# EAGLE schematic e1-tracer (EAGLE 7.7.0)
REVISION: v1

## Sheet 1 of 2
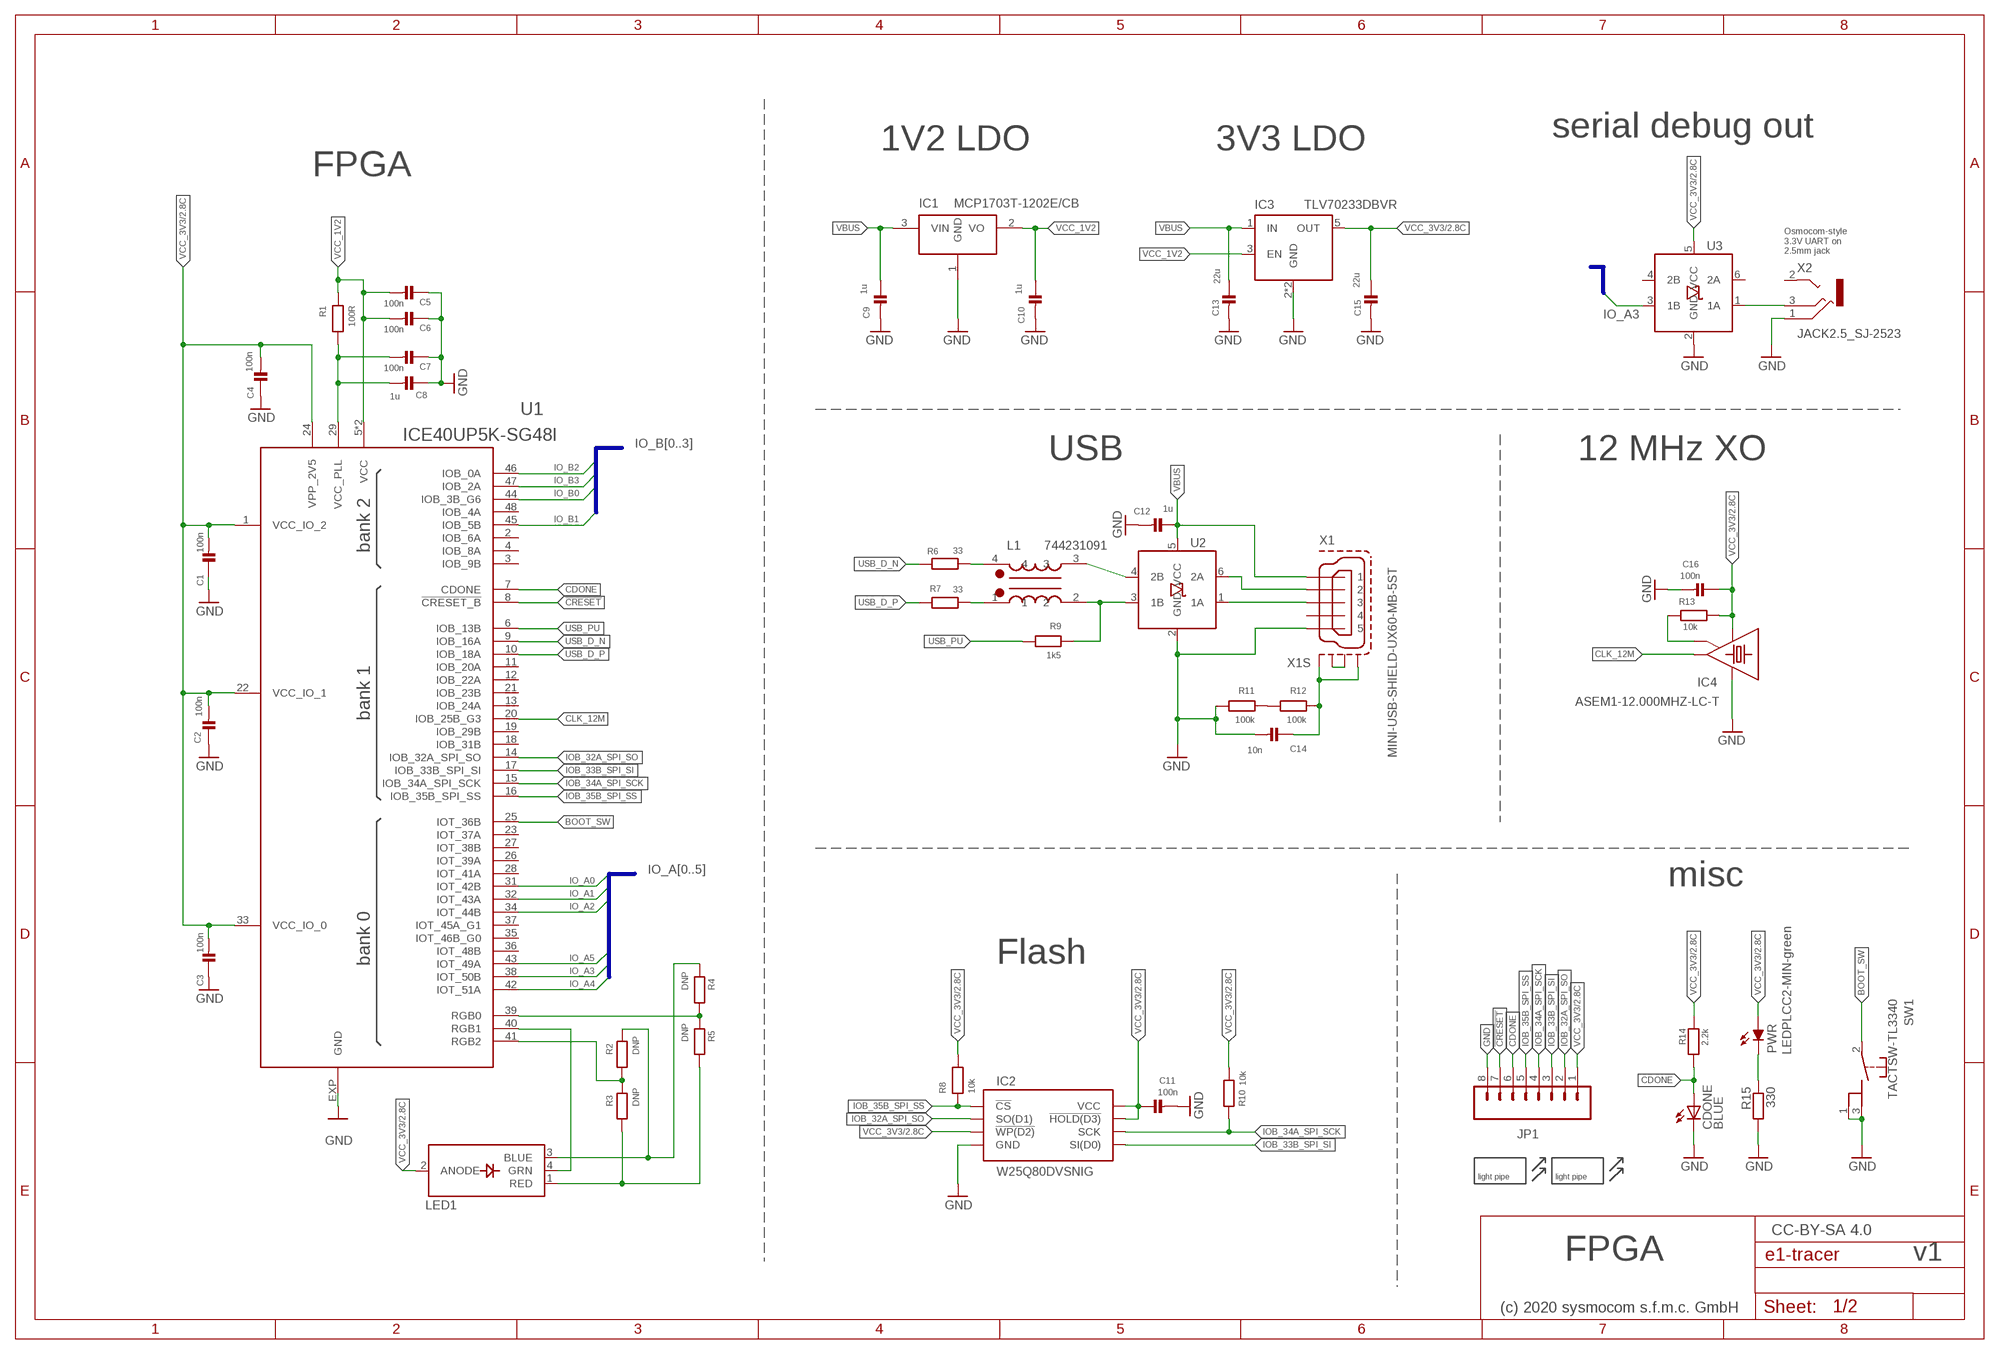
[diagram p0: schematic, sheet 1]

### Parts
C1  100n  CAP_CERAMIC_0603  [_0603]
C2  100n  CAP_CERAMIC_0603  [_0603]
C3  100n  CAP_CERAMIC_0603  [_0603]
C4  100n  CAP_CERAMIC_0603  [_0603]
C5  100n  CAP_CERAMIC_0603  [_0603]
C6  100n  CAP_CERAMIC_0603  [_0603]
C7  100n  CAP_CERAMIC_0603  [_0603]
C8  1u  CAP_CERAMIC_0603  [_0603]
C9  1u  CAP_CERAMIC_0603  [_0603]
C10  1u  CAP_CERAMIC_0603  [_0603]
C11  100n  CAP_CERAMIC_0603  [_0603]
C12  1u  CAP_CERAMIC_0603  [_0603]
C13  22u  CAP_CERAMIC1206  [1206]
C14  10n  CAP_CERAMIC_0402  [_0402]
C15  22u  CAP_CERAMIC1206  [1206]
C16  100n  CAP_CERAMIC_0603  [_0603]
CDONE  BLUE  LEDCHIPLED_0603  [CHIPLED_0603]
IC1  MCP1703T-1202E/CB  MCP1700  [SOT23-3]
IC2  W25Q80DVSNIG  AT25SF-COMB  [SO08COMBINED]
IC3  TLV70233DBVR  TLV70033-SOT  [SOT23-DBV]
IC4  ASEM1-12.000MHZ-LC-T  ASTMLP-E-OSC  [TSX-3225]
JP1  M08LOCK  [1X08_LOCK]
L1  744231091  WE-CNSW_0805  [WE-CNSW_0805]
LED1  LED_RGB_PLCC4  [RGBLED_PLCC4]
M1  MENTOR_12701001  [1270.1001]
M2  MENTOR_12701001  [1270.1001]
PWR  LEDPLCC2-MIN-green  LEDPLCC2-MIN  [PLCC2-MIN]
R1  100R  RESISTOR_0603  [_0603]
R2  DNP  RESISTOR_0603  [_0603]
R3  DNP  RESISTOR_0603  [_0603]
R4  DNP  RESISTOR_0603  [_0603]
R5  DNP  RESISTOR_0603  [_0603]
R6  33  RESISTOR_0402  [_0402]
R7  33  RESISTOR_0402  [_0402]
R8  10k  RESISTOR_0603  [_0603]
R9  1k5  RESISTOR_0603  [_0603]
R10  10k  RESISTOR_0603  [_0603]
R11  100k  RESISTOR_0603  [_0603]
R12  100k  RESISTOR_0603  [_0603]
R13  10k  RESISTOR_0603  [_0603]
R14  2.2k  RESISTOR_0603  [_0603]
R15  330  RESISTOR_0603  [_0603]
SW1  TACTSW-TL3340  TL3340  [TL3340-ORIG]
U1  ICE40UP5K-SG48I  [QFN48]
U2  IP4234CZ6  [TSOP-6]
U3  IP4234CZ6  [TSOP-6]
X1  MINI-USB-SHIELD-UX60-MB-5ST  [UX60-MB-5ST]
X2  JACK2.5_SJ-2523  [JACK2.5_SJ-2523]

### Nets
!CRESET: JP1.7 U1.8(!CRESET_B)
_D_N [usb]: L1.4 R6.2
_D_P [usb]: L1.1 R7.2
BOOT_SW: SW1.2 U1.25(IOT_36B)
CDONE: CDONE.A JP1.6 R14.2 U1.7(CDONE)
CLK_12M: IC4.3(OUT) U1.20(IOB_25B_G3)
GND [supply]: C1.1 C2.1 C3.1 C4.1 C5.1 C6.1 C7.1 C8.1 C9.2 C10.2 C11.2 C12.2 C13.2 C14.2 C15.2 C16.2 CDONE.C IC1.1(GND) IC2.4(GND) IC3.2(GND) IC3.4(GND) IC4.2(GND) JP1.8 R11.1 R15.2 SW1.1 SW1.3 U1.EXP(GND) U2.2(GND) U3.2(GND) X1.5 X2.1(RING) ; also sheet 2
IO_A0: U1.31(IOT_42B) ; also sheet 2
IO_A1: U1.32(IOT_43A) ; also sheet 2
IO_A2: U1.34(IOT_44B) ; also sheet 2
IO_A3: U1.38(IOT_50B) U3.3(1B)
IO_A4: U1.42(IOT_51A) ; also sheet 2
IO_A5: U1.43(IOT_49A) ; also sheet 2
IO_B0: U1.44(IOB_3B_G6) ; also sheet 2
IO_B1: U1.45(IOB_5B) ; also sheet 2
IO_B2: U1.46(IOB_0A) ; also sheet 2
IO_B3: U1.47(IOB_2A) ; also sheet 2
IOB_32A_SPI_SO: IC2.2(SO(D1)) JP1.2 U1.14(IOB_32A_SPI_SO)
IOB_33B_SPI_SI: IC2.5(SI(D0)) JP1.3 U1.17(IOB_33B_SPI_SI)
IOB_34A_SPI_SCK: IC2.6(SCK) JP1.4 R10.1 U1.15(IOB_34A_SPI_SCK)
IOB_35B_SPI_SS: IC2.1(!CS) JP1.5 R8.1 U1.16(IOB_35B_SPI_SS)
N$25: IC4.1(OE/!ST) R13.1
N$29: PWR.K(C) R15.1
N$36: X1.M2(S2) X1.M3(S3)
N$45: R2.2 R3.1 U1.41(RGB2)
N$46: LED1.1(RED) R3.2 R5.2
N$52: C7.2 C8.2 R1.1 U1.29(VCC_PLL)
N$55: R11.2 R12.1
N$61: C14.1 R12.2 X1.M1(S1) X1.M4(S4)
N$63: R4.2 R5.1 U1.39(RGB0)
N$64: LED1.4(GRN) U1.40(RGB1)
N$65: LED1.3(BLUE) R2.1 R4.1
UART_TX0: U3.1(1A) X2.3(MIDDLE)
USB0_D_N [usb]: U2.6(2A) X1.2
USB0_D_P [usb]: U2.1(1A) X1.3
USB1_D_N [usb]: L1.3 U2.4(2B)
USB1_D_P [usb]: L1.2 R9.2 U2.3(1B)
USB_D_N [usb]: R6.1 U1.9(IOB_16A)
USB_D_P [usb]: R7.1 U1.10(IOB_18A)
USB_PU: R9.1 U1.6(IOB_13B)
VBUS [supply]: C9.1 C12.1 C13.1 IC1.3(VIN) IC3.1(IN) U2.5(VCC) X1.1
VCC_1V2 [supply]: C5.2 C6.2 C10.1 IC1.2(VO) IC3.3(EN) R1.2 U1.5(VCC) U1.30(VCC)
VCC_3V3 [supply]: C1.2 C2.2 C3.2 C4.2 C11.1 C15.1 C16.1 IC2.3(!WP(D2)) IC2.7(!HOLD(D3)) IC2.8(VCC) IC3.5(OUT) IC4.4(VCC) JP1.1 LED1.2(ANODE) PWR.A R8.2 R10.2 R13.2 R14.1 U1.1(VCC_IO_2) U1.22(VCC_IO_1) U1.24(VPP_2V5) U1.33(VCC_IO_0) U3.5(VCC) ; also sheet 2
Unconnected: U1.2(IOB_6A) U1.3(IOB_9B) U1.4(IOB_8A) U1.11(IOB_20A) U1.12(IOB_22A) U1.13(IOB_24A) U1.18(IOB_31B) U1.19(IOB_29B) U1.21(IOB_23B) U1.23(IOT_37A) U1.26(IOT_39A) U1.27(IOT_38B) U1.28(IOT_41A) U1.35(IOT_46B_G0) U1.36(IOT_48B) U1.37(IOT_45A_G1) U1.48(IOB_4A) U3.4(2B) U3.6(2A) X1.4 X2.2(TIP)

### Buses
IO_B[0..3]
IO_A[0..5]

### Notes on the sheet
- serial debug out
- 1V2 LDO | 3V3 LDO
- FPGA
- Osmocom-style
  3.3V UART on
  2.5mm jack
- USB | 12 MHz XO
- misc
- Flash
- CC-BY-SA 4.0
- FPGA
- (c) 2020 sysmocom s.f.m.c. GmbH

## Sheet 2 of 2
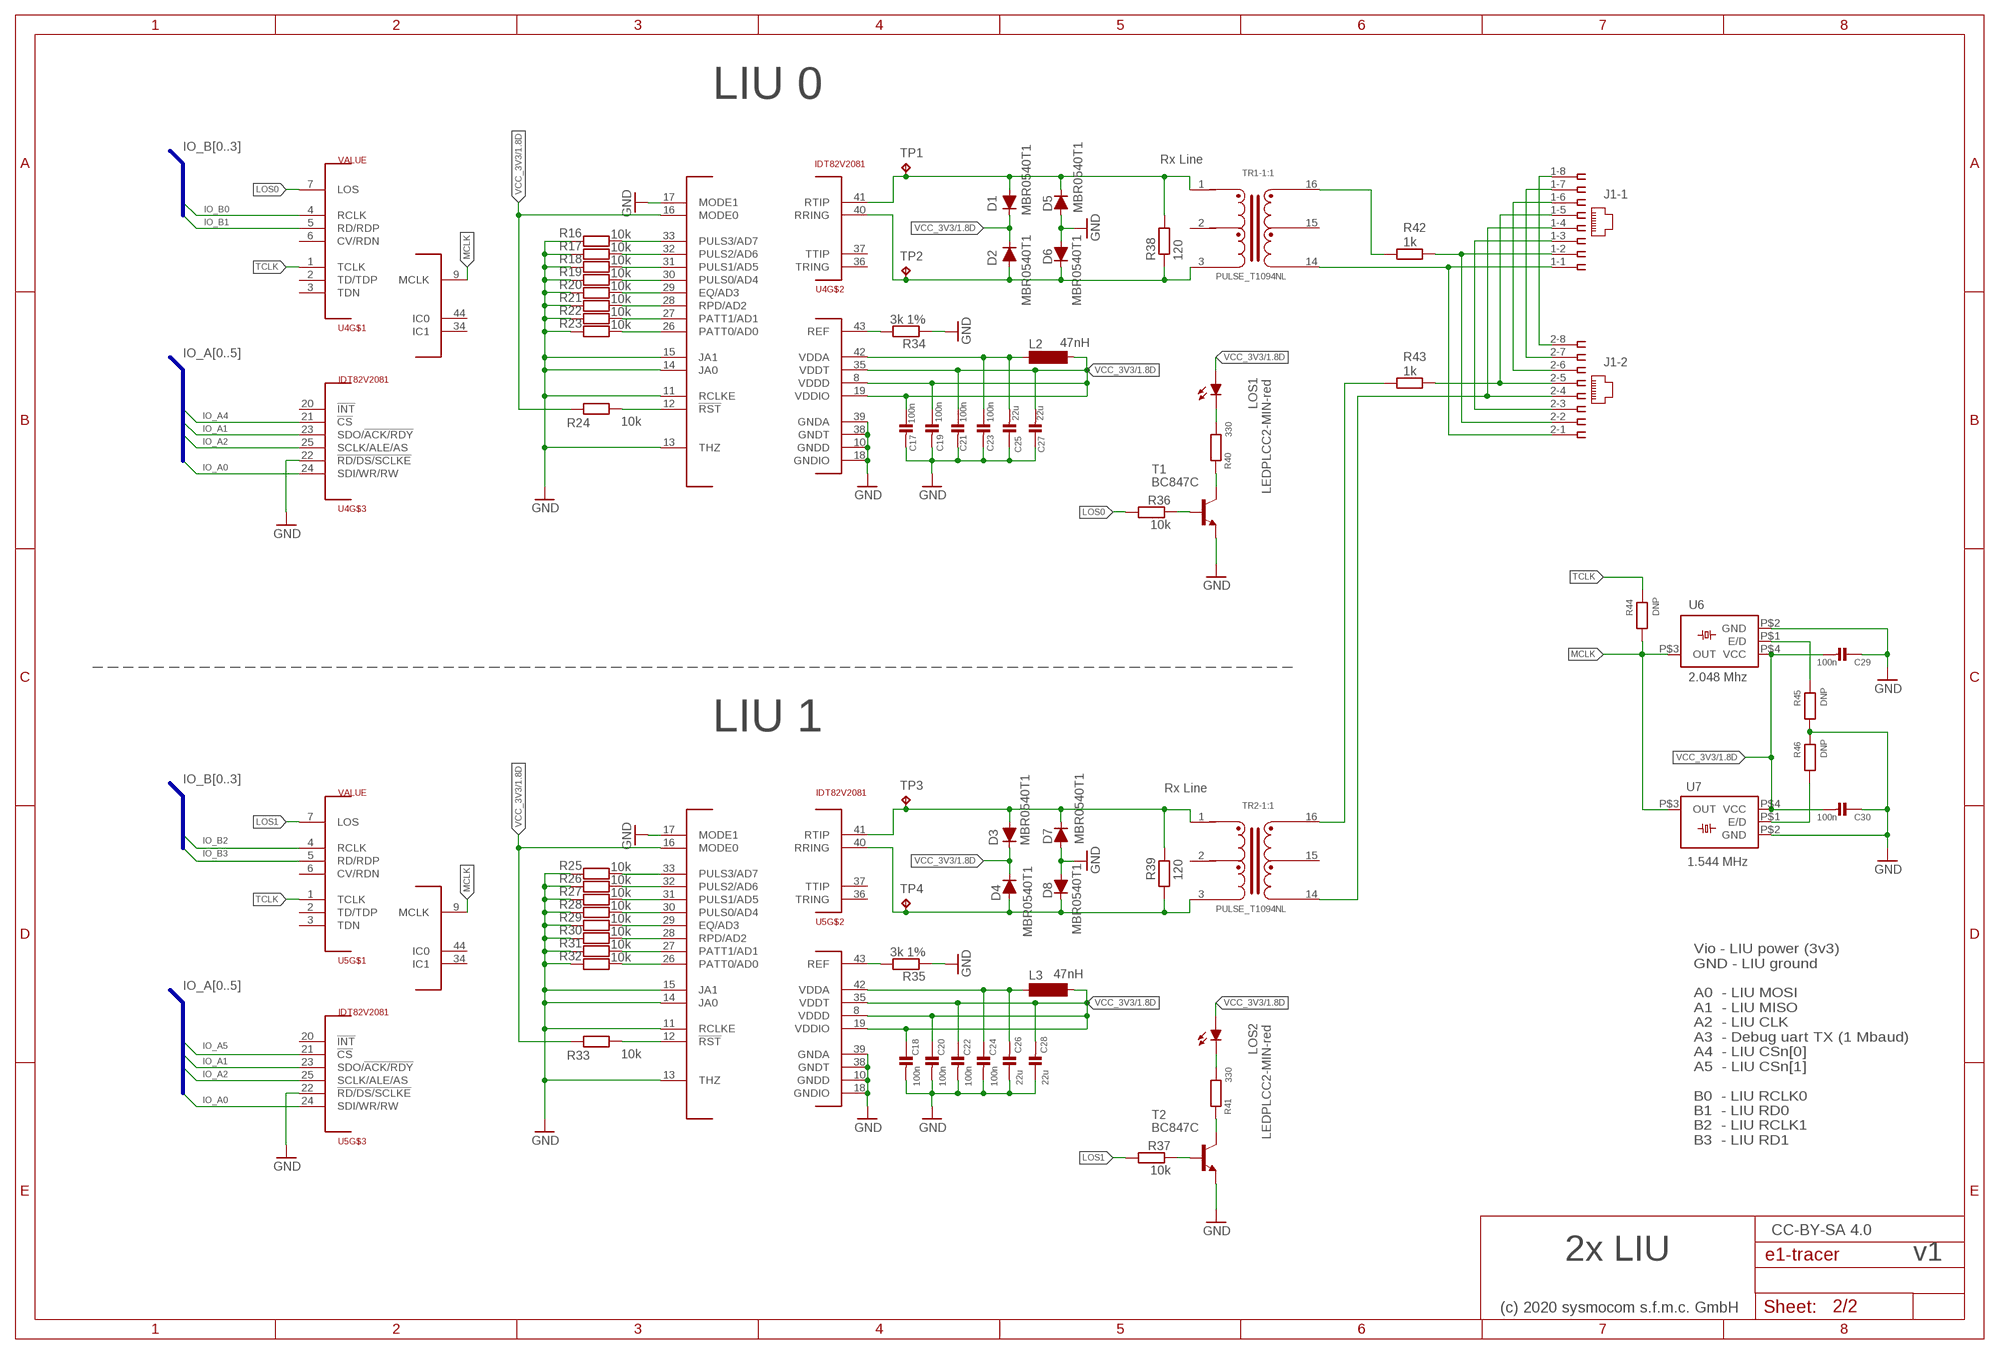
[diagram p1: schematic, sheet 2]

### Parts
C17  100n  CAP_CERAMIC_0603  [_0603]
C18  100n  CAP_CERAMIC_0603  [_0603]
C19  100n  CAP_CERAMIC_0603  [_0603]
C20  100n  CAP_CERAMIC_0603  [_0603]
C21  100n  CAP_CERAMIC_0603  [_0603]
C22  100n  CAP_CERAMIC_0603  [_0603]
C23  100n  CAP_CERAMIC_0603  [_0603]
C24  100n  CAP_CERAMIC_0603  [_0603]
C25  22u  CAP_CERAMIC_0805  [_0805]
C26  22u  CAP_CERAMIC_0805  [_0805]
C27  22u  CAP_CERAMIC_0805  [_0805]
C28  22u  CAP_CERAMIC_0805  [_0805]
C29  100n  CAP_CERAMIC_0603  [_0603]
C30  100n  CAP_CERAMIC_0603  [_0603]
D1  MBR0540T1  D-FILL-SOD123  [SOD123]
D2  MBR0540T1  D-FILL-SOD123  [SOD123]
D3  MBR0540T1  D-FILL-SOD123  [SOD123]
D4  MBR0540T1  D-FILL-SOD123  [SOD123]
D5  MBR0540T1  D-FILL-SOD123  [SOD123]
D6  MBR0540T1  D-FILL-SOD123  [SOD123]
D7  MBR0540T1  D-FILL-SOD123  [SOD123]
D8  MBR0540T1  D-FILL-SOD123  [SOD123]
J1  PASSTHROUGH  557560-1  [557560-1]
L2  47nH  SM-1206  [SM-1206]
L3  47nH  SM-1206  [SM-1206]
LOS1  LEDPLCC2-MIN-red  LEDPLCC2-MIN  [PLCC2-MIN]
LOS2  LEDPLCC2-MIN-red  LEDPLCC2-MIN  [PLCC2-MIN]
R16  10k  RESISTOR_0603  [_0603]
R17  10k  RESISTOR_0603  [_0603]
R18  10k  RESISTOR_0603  [_0603]
R19  10k  RESISTOR_0603  [_0603]
R20  10k  RESISTOR_0603  [_0603]
R21  10k  RESISTOR_0603  [_0603]
R22  10k  RESISTOR_0603  [_0603]
R23  10k  RESISTOR_0603  [_0603]
R24  10k  RESISTOR_0603  [_0603]
R25  10k  RESISTOR_0603  [_0603]
R26  10k  RESISTOR_0603  [_0603]
R27  10k  RESISTOR_0603  [_0603]
R28  10k  RESISTOR_0603  [_0603]
R29  10k  RESISTOR_0603  [_0603]
R30  10k  RESISTOR_0603  [_0603]
R31  10k  RESISTOR_0603  [_0603]
R32  10k  RESISTOR_0603  [_0603]
R33  10k  RESISTOR_0603  [_0603]
R34  3k 1%  RESISTOR_0603  [_0603]
R35  3k 1%  RESISTOR_0603  [_0603]
R36  10k  RESISTOR_0603  [_0603]
R37  10k  RESISTOR_0603  [_0603]
R38  120  RESISTOR_0603  [_0603]
R39  120  RESISTOR_0603  [_0603]
R40  330  RESISTOR_0603  [_0603]
R41  330  RESISTOR_0603  [_0603]
R42  1k  RESISTOR_0603  [_0603]
R43  1k  RESISTOR_0603  [_0603]
R44  DNP  RESISTOR_0603  [_0603]
R45  DNP  RESISTOR_0603  [_0603]
R46  DNP  RESISTOR_0603  [_0603]
T1  BC847C  BC847C-NPN-SOT23-BEC  [SOT23-BEC]
T2  BC847C  BC847C-NPN-SOT23-BEC  [SOT23-BEC]
TP1  TPTP12R  [TP12R]
TP2  TPTP12R  [TP12R]
TP3  TPTP12R  [TP12R]
TP4  TPTP12R  [TP12R]
TR1  PULSE_T1094NL  [PULSE_BH]
TR2  PULSE_T1094NL  [PULSE_BH]
U4  IDT82V2081  [TQFP44]
U5  IDT82V2081  [TQFP44]
U6  2.048 Mhz  FOX_FXO-HC73  [HC73]
U7  1.544 MHz  FOX_FXO-HC73  [HC73]

### Nets
GND [supply]: C17.2 C18.2 C19.2 C20.2 C21.2 C22.2 C23.2 C24.2 C25.1 C26.1 C27.1 C28.1 C29.1 C30.1 D5.2(A) D6.2(A) D7.2(A) D8.2(A) R16.2 R17.2 R18.2 R19.2 R20.2 R21.2 R22.2 R23.2 R25.2 R26.2 R27.2 R28.2 R29.2 R30.2 R31.2 R32.2 R34.1 R35.1 R45.2 R46.1 T1.E T2.E U4.10(GNDD) U4.11(RCLKE) U4.13(THZ) U4.14(JA0) U4.15(JA1) U4.17(MODE1) U4.18(GNDIO) U4.22(!RD/DS/SCLKE) U4.38(GNDT) U4.39(GNDA) U5.10(GNDD) U5.11(RCLKE) U5.13(THZ) U5.14(JA0) U5.15(JA1) U5.17(MODE1) U5.18(GNDIO) U5.22(!RD/DS/SCLKE) U5.38(GNDT) U5.39(GNDA) U6.P$2(GND) U7.P$2(GND) ; also sheet 1
IO_A0: U4.24(SDI/WR/RW) U5.24(SDI/WR/RW) ; also sheet 1
IO_A1: U4.23(SDO/!ACK/RDY) U5.23(SDO/!ACK/RDY) ; also sheet 1
IO_A2: U4.25(SCLK/ALE/AS) U5.25(SCLK/ALE/AS) ; also sheet 1
IO_A4: U4.21(!CS) ; also sheet 1
IO_A5: U5.21(!CS) ; also sheet 1
IO_B0: U4.4(RCLK) ; also sheet 1
IO_B1: U4.5(RD/RDP) ; also sheet 1
IO_B2: U5.4(RCLK) ; also sheet 1
IO_B3: U5.5(RD/RDP) ; also sheet 1
LOS0: R36.2 U4.7(LOS)
LOS1: R37.2 U5.7(LOS)
MCLK: R44.2 U4.9(MCLK) U5.9(MCLK) U6.P$3(OUT) U7.P$3(OUT)
N$1: R35.2 U5.43(REF)
N$2: R33.1 U5.12(!RST)
N$3 [supply]: C24.1 C26.2 L3.1 U5.42(VDDA)
N$4: R34.2 U4.43(REF)
N$5: R43.2 TR2.16
N$6: R25.1 U5.33(PULS3/AD7)
N$7: R26.1 U5.32(PULS2/AD6)
N$8: R16.1 U4.33(PULS3/AD7)
N$9: R17.1 U4.32(PULS2/AD6)
N$10: R18.1 U4.31(PULS1/AD5)
N$11: R19.1 U4.30(PULS0/AD4)
N$12: R20.1 U4.29(EQ/AD3)
N$13: R21.1 U4.28(RPD/AD2)
N$14: R22.1 U4.27(PATT1/AD1)
N$15: R27.1 U5.31(PULS1/AD5)
N$16: R28.1 U5.30(PULS0/AD4)
N$17: R24.1 U4.12(!RST)
N$18: R23.1 U4.26(PATT0/AD0)
N$19: R29.1 U5.29(EQ/AD3)
N$20: R30.1 U5.28(RPD/AD2)
N$21: R31.1 U5.27(PATT1/AD1)
N$22: R32.1 U5.26(PATT0/AD0)
N$23 [supply]: C23.1 C25.2 L2.1 U4.42(VDDA)
N$24: J1.1-4 J1.2-4 TR2.14
N$26: R36.1 T1.B
N$27: LOS1.K(C) R40.1
N$28: R40.2 T1.C
N$30: J1.1-2 J1.2-2 R42.1
N$31: R37.1 T2.B
N$32: J1.1-1 J1.2-1 TR1.14
N$33: J1.1-8 J1.2-8
N$34: J1.1-7 J1.2-7
N$35: R45.1 U6.P$1(E/D)
N$37: LOS2.K(C) R41.1
N$38: R46.2 U7.P$1(E/D)
N$39: R41.2 T2.C
N$40: J1.1-6 J1.2-6
N$41: J1.1-5 J1.2-5 R43.1
N$42: R42.2 TR1.16
N$43: J1.1-3 J1.2-3
RRING: D2.2(A) D6.1(C) R38.1 TP2.TP TR1.3 U4.40(RRING)
RRING1: D4.2(A) D8.1(C) R39.1 TP4.TP TR2.3 U5.40(RRING)
RTIP: D1.2(A) D5.1(C) R38.2 TP1.TP TR1.1 U4.41(RTIP)
RTIP1: D3.2(A) D7.1(C) R39.2 TP3.TP TR2.1 U5.41(RTIP)
TCLK: R44.1 U4.1(TCLK) U5.1(TCLK)
VCC_3V3 [supply]: C17.1 C18.1 C19.1 C20.1 C21.1 C22.1 C27.2 C28.2 C29.2 C30.2 D1.1(C) D2.1(C) D3.1(C) D4.1(C) L2.2 L3.2 LOS1.A LOS2.A R24.2 R33.2 U4.8(VDDD) U4.16(MODE0) U4.19(VDDIO) U4.35(VDDT) U5.8(VDDD) U5.16(MODE0) U5.19(VDDIO) U5.35(VDDT) U6.P$4(VCC) U7.P$4(VCC) ; also sheet 1
Unconnected: TR1.2 TR1.6 TR1.7 TR1.8 TR1.9 TR1.10 TR1.11 TR1.15 TR2.2 TR2.6 TR2.7 TR2.8 TR2.9 TR2.10 TR2.11 TR2.15 U4.2(TD/TDP) U4.3(TDN) U4.6(CV/RDN) U4.20(!INT) U4.34(IC1) U4.36(TRING) U4.37(TTIP) U4.44(IC0) U5.2(TD/TDP) U5.3(TDN) U5.6(CV/RDN) U5.20(!INT) U5.34(IC1) U5.36(TRING) U5.37(TTIP) U5.44(IC0)

### Buses
IO_B[0..3]
IO_A[0..5]

### Notes on the sheet
- LIU 0
- Rx Line
- LIU 1
- Rx Line
- Vio - LIU power (3v3)
  GND - LIU ground
  
  A0  - LIU MOSI
  A1  - LIU MISO
  A2  - LIU CLK
  A3  - Debug uart TX (1 Mbaud)
  A4  - LIU CSn[0]
  A5  - LIU CSn[1]
  
  B0  - LIU RCLK0
  B1  - LIU RD0
  B2  - LIU RCLK1
  B3  - LIU RD1
- CC-BY-SA 4.0
- 2x LIU
- (c) 2020 sysmocom s.f.m.c. GmbH

## Library data of the parts
C1-C7 C11 C16-C24 C29 C30 = rc-sysmocom:CAP_CERAMIC: Ceramic Capacitors 0402 - 0402 Surface Mount Capacitors 16pF 50V 5% [Digikey: 445-4899-2-ND] 18pF 50V 5% [Digikey: 490-1281-2-ND] 22pF 50V 5% [Digikey: 490-1283-2-ND] 68pF 50V 5% [Digikey: 490-1289-2-ND] 0.1uF 10V 10% [Digikey: 490-1318-2-ND] 1.0uF 6.3V 10% [Digikey: 490-1320-2-ND] 0603 - 0603 Surface Mount Capacitors 16 pF 50V 5% [Digikey: 445-5051-2-ND] 22 pF 50V [Digikey: PCC220ACVTR-ND] 33 pF 50V 5% [Digikey: 490-1415-1-ND] 56pF 50V 5% [Digikey: 490-1421-1-ND] 220pF 50V 5% [Digikey: 445-1285-1-ND] 680 pF 50V 2200 pF 50V 5% C0G [Digikey: 445-1297-1-ND] 5600 pF 100V 5% X7R [Digikey: 478-3711-1-ND] 0.1 µF 25V 10% [Digikey: PCC2277TR-ND] 0.22 µF 16V 10% X7R [Digikey: 445-1318-1-ND] 1.0 µF 25V 10% [Digikey: 445-5146-2-ND] 0603 - RF Specific 3pF 250V +/-0.1pF RF [Digikey: 712-1347-1-ND] 18 pF 250V 5% [Digikey: 478-3505-1-ND or 712-1322-1-ND] 56 pF 250V 5% C0G RF [Digikey: 490-4867-1-ND] 68 pF 250V RF [Digikey: 490-4868-1-ND] 0805 - 0805 Surface Mount Capacitors 220 pF 250V 2% RF Ceramic Capacitor [Digikey: 712-1398-1-ND] 1000 pF 50V 2% NP0 Ceramic Capacitor [Digikey: 478-3760-1-ND] 0.1 µF 25V 10% Ceramic Capacitor [Digikey: PCC1828TR-ND] 1.0 µF 16V 10% Ceramic Capacitor[Digikey: 490-1691-2-ND] 10.0 µF 10V 10% Ceramic Capacitor[Digikey: 709-1228-1-ND] 10.0 uF 16V 10% Ceramic Capacitor [Digikey: 478-5165-2-ND] 47 uF 6.3V 20% Ceramic Capacitor [Digikey: 587-1779-1-ND or 399-5506-1-ND] 1206 - 1206 Surface Mount Capacitors 47uF 10V 20% Ceramic Capacitor [Digikey: 490-5528-1-ND or 399-5508-1-ND or 445-6010-1-ND] 100uF 6.3V -20%, +80% Y5V Ceramic Capacitor (Digikey: 490-4512-1-ND, Mouser: 81-GRM31CF50J107ZE1L) 1810 - 1810 Surface Mount Capacitors High volt MLC; no solder stop between for higher isolation; CLASS: CAPACITOR; DESCRIPTION: CAP CER 0.1UF 16V 10% X7R 0603; LINK: http://www.digikey.de/product-detail/de/foo/1276-1005-1-ND; MANUFACTURER: Samsung Electro-Mechanics America, Inc; MANUFACTURERPARTNUMBER: CL10B104KO8NNNC; POPULATED: TRUE; ROHSCERTIFICATE: Bleifrei / RoHS-konform; SOURCE: DIGIKEY; SOURCEPARTNUMBER: 1276-1005-1-ND
C8-C10 C12 = rc-sysmocom:CAP_CERAMIC: Ceramic Capacitors 0402 - 0402 Surface Mount Capacitors 16pF 50V 5% [Digikey: 445-4899-2-ND] 18pF 50V 5% [Digikey: 490-1281-2-ND] 22pF 50V 5% [Digikey: 490-1283-2-ND] 68pF 50V 5% [Digikey: 490-1289-2-ND] 0.1uF 10V 10% [Digikey: 490-1318-2-ND] 1.0uF 6.3V 10% [Digikey: 490-1320-2-ND] 0603 - 0603 Surface Mount Capacitors 16 pF 50V 5% [Digikey: 445-5051-2-ND] 22 pF 50V [Digikey: PCC220ACVTR-ND] 33 pF 50V 5% [Digikey: 490-1415-1-ND] 56pF 50V 5% [Digikey: 490-1421-1-ND] 220pF 50V 5% [Digikey: 445-1285-1-ND] 680 pF 50V 2200 pF 50V 5% C0G [Digikey: 445-1297-1-ND] 5600 pF 100V 5% X7R [Digikey: 478-3711-1-ND] 0.1 µF 25V 10% [Digikey: PCC2277TR-ND] 0.22 µF 16V 10% X7R [Digikey: 445-1318-1-ND] 1.0 µF 25V 10% [Digikey: 445-5146-2-ND] 0603 - RF Specific 3pF 250V +/-0.1pF RF [Digikey: 712-1347-1-ND] 18 pF 250V 5% [Digikey: 478-3505-1-ND or 712-1322-1-ND] 56 pF 250V 5% C0G RF [Digikey: 490-4867-1-ND] 68 pF 250V RF [Digikey: 490-4868-1-ND] 0805 - 0805 Surface Mount Capacitors 220 pF 250V 2% RF Ceramic Capacitor [Digikey: 712-1398-1-ND] 1000 pF 50V 2% NP0 Ceramic Capacitor [Digikey: 478-3760-1-ND] 0.1 µF 25V 10% Ceramic Capacitor [Digikey: PCC1828TR-ND] 1.0 µF 16V 10% Ceramic Capacitor[Digikey: 490-1691-2-ND] 10.0 µF 10V 10% Ceramic Capacitor[Digikey: 709-1228-1-ND] 10.0 uF 16V 10% Ceramic Capacitor [Digikey: 478-5165-2-ND] 47 uF 6.3V 20% Ceramic Capacitor [Digikey: 587-1779-1-ND or 399-5506-1-ND] 1206 - 1206 Surface Mount Capacitors 47uF 10V 20% Ceramic Capacitor [Digikey: 490-5528-1-ND or 399-5508-1-ND or 445-6010-1-ND] 100uF 6.3V -20%, +80% Y5V Ceramic Capacitor (Digikey: 490-4512-1-ND, Mouser: 81-GRM31CF50J107ZE1L) 1810 - 1810 Surface Mount Capacitors High volt MLC; no solder stop between for higher isolation; CLASS: CAPACITOR; DESCRIPTION: CAP CER 1UF 10V X5R 0603; LINK: https://www.digikey.de/product-detail/de/samsung-electro-mechanics/CL10A105KP8NNNC/1276-1182-1-ND/3889268; MANUFACTURER: Samsung Electro-Mechanics; MANUFACTURERPARTNUMBER: CL10A105KP8NNNC; POPULATED: TRUE; ROHSCERTIFICATE: Bleifrei / RoHS-konform; SOURCE: DIGIKEY; SOURCEPARTNUMBER: 1276-1182-1-ND
C13 C15 = rc-sysmocom:CAP_CERAMIC: Ceramic Capacitors 0402 - 0402 Surface Mount Capacitors 16pF 50V 5% [Digikey: 445-4899-2-ND] 18pF 50V 5% [Digikey: 490-1281-2-ND] 22pF 50V 5% [Digikey: 490-1283-2-ND] 68pF 50V 5% [Digikey: 490-1289-2-ND] 0.1uF 10V 10% [Digikey: 490-1318-2-ND] 1.0uF 6.3V 10% [Digikey: 490-1320-2-ND] 0603 - 0603 Surface Mount Capacitors 16 pF 50V 5% [Digikey: 445-5051-2-ND] 22 pF 50V [Digikey: PCC220ACVTR-ND] 33 pF 50V 5% [Digikey: 490-1415-1-ND] 56pF 50V 5% [Digikey: 490-1421-1-ND] 220pF 50V 5% [Digikey: 445-1285-1-ND] 680 pF 50V 2200 pF 50V 5% C0G [Digikey: 445-1297-1-ND] 5600 pF 100V 5% X7R [Digikey: 478-3711-1-ND] 0.1 µF 25V 10% [Digikey: PCC2277TR-ND] 0.22 µF 16V 10% X7R [Digikey: 445-1318-1-ND] 1.0 µF 25V 10% [Digikey: 445-5146-2-ND] 0603 - RF Specific 3pF 250V +/-0.1pF RF [Digikey: 712-1347-1-ND] 18 pF 250V 5% [Digikey: 478-3505-1-ND or 712-1322-1-ND] 56 pF 250V 5% C0G RF [Digikey: 490-4867-1-ND] 68 pF 250V RF [Digikey: 490-4868-1-ND] 0805 - 0805 Surface Mount Capacitors 220 pF 250V 2% RF Ceramic Capacitor [Digikey: 712-1398-1-ND] 1000 pF 50V 2% NP0 Ceramic Capacitor [Digikey: 478-3760-1-ND] 0.1 µF 25V 10% Ceramic Capacitor [Digikey: PCC1828TR-ND] 1.0 µF 16V 10% Ceramic Capacitor[Digikey: 490-1691-2-ND] 10.0 µF 10V 10% Ceramic Capacitor[Digikey: 709-1228-1-ND] 10.0 uF 16V 10% Ceramic Capacitor [Digikey: 478-5165-2-ND] 47 uF 6.3V 20% Ceramic Capacitor [Digikey: 587-1779-1-ND or 399-5506-1-ND] 1206 - 1206 Surface Mount Capacitors 47uF 10V 20% Ceramic Capacitor [Digikey: 490-5528-1-ND or 399-5508-1-ND or 445-6010-1-ND] 100uF 6.3V -20%, +80% Y5V Ceramic Capacitor (Digikey: 490-4512-1-ND, Mouser: 81-GRM31CF50J107ZE1L) 1810 - 1810 Surface Mount Capacitors High volt MLC; no solder stop between for higher isolation; CLASS: CAPACITOR; DESCRIPTION: CAP CER 22UF 10V 10% X5R 1206; LINK: http://www.digikey.de/product-detail/de/foo/1276-1287-1-ND; MANUFACTURER: Samsung Electro-Mechanics America, Inc; MANUFACTURERPARTNUMBER: CL31A226KPHNNNE; POPULATED: TRUE; ROHSCERTIFICATE: Bleifrei / RoHS-konform; SOURCE: DIGIKEY; SOURCEPARTNUMBER: 1276-1287-1-ND
C14 = rc-sysmocom:CAP_CERAMIC: Ceramic Capacitors 0402 - 0402 Surface Mount Capacitors 16pF 50V 5% [Digikey: 445-4899-2-ND] 18pF 50V 5% [Digikey: 490-1281-2-ND] 22pF 50V 5% [Digikey: 490-1283-2-ND] 68pF 50V 5% [Digikey: 490-1289-2-ND] 0.1uF 10V 10% [Digikey: 490-1318-2-ND] 1.0uF 6.3V 10% [Digikey: 490-1320-2-ND] 0603 - 0603 Surface Mount Capacitors 16 pF 50V 5% [Digikey: 445-5051-2-ND] 22 pF 50V [Digikey: PCC220ACVTR-ND] 33 pF 50V 5% [Digikey: 490-1415-1-ND] 56pF 50V 5% [Digikey: 490-1421-1-ND] 220pF 50V 5% [Digikey: 445-1285-1-ND] 680 pF 50V 2200 pF 50V 5% C0G [Digikey: 445-1297-1-ND] 5600 pF 100V 5% X7R [Digikey: 478-3711-1-ND] 0.1 µF 25V 10% [Digikey: PCC2277TR-ND] 0.22 µF 16V 10% X7R [Digikey: 445-1318-1-ND] 1.0 µF 25V 10% [Digikey: 445-5146-2-ND] 0603 - RF Specific 3pF 250V +/-0.1pF RF [Digikey: 712-1347-1-ND] 18 pF 250V 5% [Digikey: 478-3505-1-ND or 712-1322-1-ND] 56 pF 250V 5% C0G RF [Digikey: 490-4867-1-ND] 68 pF 250V RF [Digikey: 490-4868-1-ND] 0805 - 0805 Surface Mount Capacitors 220 pF 250V 2% RF Ceramic Capacitor [Digikey: 712-1398-1-ND] 1000 pF 50V 2% NP0 Ceramic Capacitor [Digikey: 478-3760-1-ND] 0.1 µF 25V 10% Ceramic Capacitor [Digikey: PCC1828TR-ND] 1.0 µF 16V 10% Ceramic Capacitor[Digikey: 490-1691-2-ND] 10.0 µF 10V 10% Ceramic Capacitor[Digikey: 709-1228-1-ND] 10.0 uF 16V 10% Ceramic Capacitor [Digikey: 478-5165-2-ND] 47 uF 6.3V 20% Ceramic Capacitor [Digikey: 587-1779-1-ND or 399-5506-1-ND] 1206 - 1206 Surface Mount Capacitors 47uF 10V 20% Ceramic Capacitor [Digikey: 490-5528-1-ND or 399-5508-1-ND or 445-6010-1-ND] 100uF 6.3V -20%, +80% Y5V Ceramic Capacitor (Digikey: 490-4512-1-ND, Mouser: 81-GRM31CF50J107ZE1L) 1810 - 1810 Surface Mount Capacitors High volt MLC; no solder stop between for higher isolation; CLASS: CAPACITOR; DESCRIPTION: CAP CER 10000PF 25V X7R 0402; LINK: https://www.digikey.de/product-detail/de/samsung-electro-mechanics/CL05B103KA5NNNC/1276-1057-1-ND/3889143; MANUFACTURER: Samsung Electro-Mechanics; MANUFACTURERPARTNUMBER: CL05B103KA5NNNC; POPULATED: TRUE; ROHSCERTIFICATE: Bleifrei / RoHS-konform; SOURCE: DIGIKEY; SOURCEPARTNUMBER: 1276-1057-1-ND
C25-C28 = rc-sysmocom:CAP_CERAMIC: Ceramic Capacitors 0402 - 0402 Surface Mount Capacitors 16pF 50V 5% [Digikey: 445-4899-2-ND] 18pF 50V 5% [Digikey: 490-1281-2-ND] 22pF 50V 5% [Digikey: 490-1283-2-ND] 68pF 50V 5% [Digikey: 490-1289-2-ND] 0.1uF 10V 10% [Digikey: 490-1318-2-ND] 1.0uF 6.3V 10% [Digikey: 490-1320-2-ND] 0603 - 0603 Surface Mount Capacitors 16 pF 50V 5% [Digikey: 445-5051-2-ND] 22 pF 50V [Digikey: PCC220ACVTR-ND] 33 pF 50V 5% [Digikey: 490-1415-1-ND] 56pF 50V 5% [Digikey: 490-1421-1-ND] 220pF 50V 5% [Digikey: 445-1285-1-ND] 680 pF 50V 2200 pF 50V 5% C0G [Digikey: 445-1297-1-ND] 5600 pF 100V 5% X7R [Digikey: 478-3711-1-ND] 0.1 µF 25V 10% [Digikey: PCC2277TR-ND] 0.22 µF 16V 10% X7R [Digikey: 445-1318-1-ND] 1.0 µF 25V 10% [Digikey: 445-5146-2-ND] 0603 - RF Specific 3pF 250V +/-0.1pF RF [Digikey: 712-1347-1-ND] 18 pF 250V 5% [Digikey: 478-3505-1-ND or 712-1322-1-ND] 56 pF 250V 5% C0G RF [Digikey: 490-4867-1-ND] 68 pF 250V RF [Digikey: 490-4868-1-ND] 0805 - 0805 Surface Mount Capacitors 220 pF 250V 2% RF Ceramic Capacitor [Digikey: 712-1398-1-ND] 1000 pF 50V 2% NP0 Ceramic Capacitor [Digikey: 478-3760-1-ND] 0.1 µF 25V 10% Ceramic Capacitor [Digikey: PCC1828TR-ND] 1.0 µF 16V 10% Ceramic Capacitor[Digikey: 490-1691-2-ND] 10.0 µF 10V 10% Ceramic Capacitor[Digikey: 709-1228-1-ND] 10.0 uF 16V 10% Ceramic Capacitor [Digikey: 478-5165-2-ND] 47 uF 6.3V 20% Ceramic Capacitor [Digikey: 587-1779-1-ND or 399-5506-1-ND] 1206 - 1206 Surface Mount Capacitors 47uF 10V 20% Ceramic Capacitor [Digikey: 490-5528-1-ND or 399-5508-1-ND or 445-6010-1-ND] 100uF 6.3V -20%, +80% Y5V Ceramic Capacitor (Digikey: 490-4512-1-ND, Mouser: 81-GRM31CF50J107ZE1L) 1810 - 1810 Surface Mount Capacitors High volt MLC; no solder stop between for higher isolation; CLASS: CAPACITOR; DESCRIPTION: CAP CER 22UF 6.3V X5R 0805; LINK: https://www.digikey.de/product-detail/de/kemet/C0805C226M9PACTU/399-4696-1-ND; MANUFACTURER: KEMET; MANUFACTURERPARTNUMBER: C0805C226M9PACTU; POPULATED: TRUE; ROHSCERTIFICATE: UNKNOWN ROHS CERTIFICATE; SOURCE: DIGIKEY; SOURCEPARTNUMBER: 399-4696-1-ND
CDONE = led:LED: LED OSRAM: - CHIPLED LG R971, LG N971, LY N971, LG Q971, LY Q971, LO R971, LY R971 LH N974, LH R974 LS Q976, LO Q976, LY Q976 LO Q996 - Hyper CHIPLED LW Q18S LB Q993, LB Q99A, LB R99A - SideLED LS A670, LO A670, LY A670, LG A670, LP A670 LB A673, LV A673, LT A673, LW A673 LH A674 LY A675 LS A676, LA A676, LO A676, LY A676, LW A676 LS A679, LY A679, LG A679 - Hyper Micro SIDELED® LS Y876, LA Y876, LO Y876, LY Y876 LT Y87S - SmartLED LW L88C, LW L88S LB L89C, LB L89S, LG L890 LS L89K, LO L89K, LY L89K LS L896, LA L896, LO L896, LY L896 - TOPLED LS T670, LO T670, LY T670, LG T670, LP T670 LSG T670, LSP T670, LSY T670, LOP T670, LYG T670 LG T671, LOG T671, LSG T671 LB T673, LV T673, LT T673, LW T673 LH T674 LS T676, LA T676, LO T676, LY T676, LB T676, LH T676, LSB T676, LW T676 LB T67C, LV T67C, LT T67C, LS T67K, LO T67K, LY T67K, LW E67C LS E67B, LA E67B, LO E67B, LY E67B, LB E67C, LV E67C, LT E67C LW T67C LS T679, LY T679, LG T679 LS T770, LO T770, LY T770, LG T770, LP T770 LB T773, LV T773, LT T773, LW T773 LH T774 LS E675, LA E675, LY E675, LS T675 LS T776, LA T776, LO T776, LY T776, LB T776 LHGB T686 LT T68C, LB T68C - Hyper Mini TOPLED® LB M676 - Mini TOPLED Santana® LG M470 LS M47K, LO M47K, LY M47K Source: http://www.osram.convergy.de LUXEON: - LUMILED® LXK2-PW12-R00, LXK2-PW12-S00, LXK2-PW14-U00, LXK2-PW14-V00 LXK2-PM12-R00, LXK2-PM12-S00, LXK2-PM14-U00 LXK2-PE12-Q00, LXK2-PE12-R00, LXK2-PE12-S00, LXK2-PE14-T00, LXK2-PE14-U00 LXK2-PB12-K00, LXK2-PB12-L00, LXK2-PB12-M00, LXK2-PB14-N00, LXK2-PB14-P00, LXK2-PB14-Q00 LXK2-PR12-L00, LXK2-PR12-M00, LXK2-PR14-Q00, LXK2-PR14-R00 LXK2-PD12-Q00, LXK2-PD12-R00, LXK2-PD12-S00 LXK2-PH12-R00, LXK2-PH12-S00 LXK2-PL12-P00, LXK2-PL12-Q00, LXK2-PL12-R00 Source: www.luxeon.com KINGBRIGHT: KA-3528ASYC Source: www.kingbright.com; CLASS: LED; DESCRIPTION: LED BLUE CLEAR CHIP SMD; LINK: https://www.digikey.de/product-detail/de/lite-on-inc/LTST-C193TBKT-5A/160-1827-1-ND; MANUFACTURER: Lite-On Inc.; MANUFACTURERPARTNUMBER: LTST-C193TBKT-5A; POPULATED: TRUE; ROHSCERTIFICATE: UNKNOWN ROHS CERTIFICATE; SOURCE: DIGIKEY; SOURCEPARTNUMBER: 160-1827-1-ND
D1-D8 = semicon-smd-ipc:D-FILL-: DIODE filled; CLASS: DIODE; DESCRIPTION: DIODE SCHOTTKY 40V 500MA SOD123; LINK: https://www.digikey.de/product-detail/de/on-semiconductor/MBR0540T1G/MBR0540T1GOSCT-ND; MANUFACTURER: ON Semiconductor; MANUFACTURERPARTNUMBER: MBR0540T1G; POPULATED: TRUE; ROHSCERTIFICATE: UNKNOWN ROHS CERTIFICATE; SOURCE: DIGIKEY; SOURCEPARTNUMBER: MBR0540T1GOSCT-ND
IC1 = MCP170x:MCP1700; CLASS: IC; DESCRIPTION: IC REG LIN 1.2V 200MA SOT23A-3; LINK: https://www.digikey.de/product-detail/de/microchip-technology/MCP1703T-1202E-CB/MCP1703T-1202E-CBCT-ND/1994670; MANUFACTURER: Microchip Technology; MANUFACTURERPARTNUMBER: MCP1703T-1202E/CB; POPULATED: TRUE; ROHSCERTIFICATE: UNKNOWN ROHS CERTIFICATE; SOURCE: DIGIKEY; SOURCEPARTNUMBER: MCP1703T-1202E/CBCT-ND
IC2 = spiflash:AT25SF; CLASS: IC; DESCRIPTION: IC FLASH 8M SPI 104MHZ 8SOIC; LINK: https://www.digikey.de/product-detail/de/winbond-electronics/W25Q80DVSNIG/W25Q80DVSNIG-ND; MANUFACTURER: Winbond Electronics; MANUFACTURERPARTNUMBER: W25Q80DVSNIG; POPULATED: TRUE; ROHSCERTIFICATE: UNKNOWN ROHS CERTIFICATE; SOURCE: DIGIKEY; SOURCEPARTNUMBER: W25Q80DVSNIG-ND
IC3 = tlv700xx:TLV700*: TLV700xx also works for SOT variants of TLV702xx and TLV733xx; CLASS: IC; DESCRIPTION: IC REG LINEAR 3.3V 300MA SOT23-5; LINK: https://www.digikey.de/product-detail/de/texas-instruments/TLV70233DBVR/296-32415-1-ND; MANUFACTURER: Texas Instruments; MANUFACTURERPARTNUMBER: TLV70233DBVR; OC_DIGIKEY: 296-32415-1-ND; POPULATED: TRUE; ROHSCERTIFICATE: UNKNOWN ROHS CERTIFICATE; SOURCE: DIGIKEY; SOURCEPARTNUMBER: 296-32415-1-ND
IC4 = Epson_TSX-3225:ASTMLP-E: ABRACOM MEMS oscillators http://abracon.com/Oscillators/ASTMLP.pdf; CLASS: IC / XTAL / XO; DESCRIPTION: MEMS OSC XO 12.0000MHZ CMOS SMD; LINK: https://www.digikey.de/product-detail/de/abracon-llc/ASEM1-12-000MHZ-LC-T/535-9757-1-ND; MANUFACTURER: Abracon LLC; MANUFACTURERPARTNUMBER: ASEM1-12.000MHZ-LC-T; POPULATED: TRUE; ROHSCERTIFICATE: UNKNOWN ROHS CERTIFICATE; SOURCE: DIGIKEY; SOURCEPARTNUMBER: 535-9757-1-ND
J1 = con-amp:557560-1: AMP connector; CLASS: CONNECTOR\JUMPER; DESCRIPTION: CONN MOD JACK 8P8C R/A UNSHLD; LINK: https://www.digikey.de/product-detail/de/te-connectivity-amp-connectors/5557560-1/A31449-ND; MANUFACTURER: TE Connectivity AMP Connectors; MANUFACTURERPARTNUMBER: 5557560-1; POPULATED: TRUE; ROHSCERTIFICATE: UNKNOWN ROHS CERTIFICATE; SOURCE: DIGIKEY; SOURCEPARTNUMBER: A31449-ND
JP1 = SparkFun-Connectors:M08: Header 8 Standard 8-pin 0.1" header. Use with straight break away headers (SKU : PRT-00116), right angle break away headers (PRT-00553), swiss pins (PRT-00743), machine pins (PRT-00117), and female headers (PRT-00115).; CLASS: CONNECTOR\JUMPER; DESCRIPTION: NO DESCRIPTION; LINK: UNKNOWN LINK; MANUFACTURER: UNKNOWN MANUFACTURER; MANUFACTURERPARTNUMBER: UNKNOWN MANUFACTURER PART NUMBER; POPULATED: TRUE; ROHSCERTIFICATE: UNKNOWN ROHS CERTIFICATE; SOURCE: UNKNOWN SOURCE; SOURCEPARTNUMBER: UNKNOWN SOURCE PART NUMBER
L1 = Wuerth_Elektronik_eiSos_V6_20140807:WE-CNSW: SMD Common Mode Noise Suppressor WE-CNSW - High common mode suppression at high frequency - Small influence for high speed signals through winding symmetry -- USB 2.0 -- Firewire / IEEE 1394 -- Power supply systems -- High Speed Data Lines -- Common mode data line filter <http://katalog.we-online.de/media/images/eisos/IndCNSW_pf2.jpg> Details see: http://katalog.we-online.de/en/pbs/WE-CNSW Updated by Dan Xu 2014-06-30 2014 (C) Würth Elektronik; CLASS: INDUCTOR; DESCRIPTION: CMC 370MA 2LN 90 OHM SMD; LINK: https://www.digikey.de/product-detail/de/wurth-electronics-inc/744231091/732-3198-1-ND; MANUFACTURER: Wurth Electronics Inc.; MANUFACTURERPARTNUMBER: 744231091; POPULATED: TRUE; ROHSCERTIFICATE: Bleifrei / RoHS-konform; SOURCE: DIGIKEY; SOURCEPARTNUMBER: 732-3198-1-ND
L2 L3 = inductor-neosid:SM-1206: INDUCTOR SMD chip inductor; CLASS: INDUCTOR; DESCRIPTION: FIXED IND 47NH 300MA 700MOHM SMD; LINK: https://www.digikey.de/product-detail/de/bourns-inc/CE201210-47NJ/CE201210-47NJCT-ND/3438045; MANUFACTURER: Bourns Inc.; MANUFACTURERPARTNUMBER: CE201210-47NJ; OC_FARNELL: unknown; OC_NEWARK: unknown; POPULATED: TRUE; ROHSCERTIFICATE: UNKNOWN ROHS CERTIFICATE; SOURCE: DIGIKEY; SOURCEPARTNUMBER: CE201210-47NJCT-ND
LED1 = microbuilder:LED_RGB_PLCC4: RGB LED - PLCC4 Cree 20mA Common Anode Digikey: CLV1A-FKB-CJ1M1F1BB7R4S3CT-ND Red: 2.6V Vf, 550mcd Green: 3.2V Vf, 850mcd Blue: 3.2V Vf, 320mcd; CLASS: LED; DESCRIPTION: LED RGB DIFFUSED 4PLCC SMD; LINK: https://www.digikey.de/product-detail/de/tt-electronics-optek-technology/OVSARGB4R8/365-1561-2-ND; MANUFACTURER: TT Electronics/Optek Technology; MANUFACTURERPARTNUMBER: OVSARGB4R8; POPULATED: TRUE; ROHSCERTIFICATE: UNKNOWN ROHS CERTIFICATE; SOURCE: DIGIKEY; SOURCEPARTNUMBER: 365-1561-2-ND
LOS1 LOS2 = LED-PLCC2:LED: OSRAM types LY T676, LS T670 in P-LLC2 package; CLASS: LED; DESCRIPTION: LED RED CLEAR 2PLCC SMD; LINK: https://www.digikey.de/product-detail/de/osram-opto-semiconductors-inc/LS-T676-R1S1-1-Z/475-2683-1-ND; MANUFACTURER: OSRAM Opto Semiconductors Inc.; MANUFACTURERPARTNUMBER: LS T676-R1S1-1-Z; POPULATED: TRUE; ROHSCERTIFICATE: UNKNOWN ROHS CERTIFICATE; SOURCE: DIGIKEY; SOURCEPARTNUMBER: 475-2683-1-ND
M1 M2 = Mentor_lightpipe:MENTOR_12701001: MENTOR 1270.1001, PCB Mounted 2-Way Right Angle LED Light Pipe, Bi-Level Clear Round Lens; CLASS: LIGHT GUIDE; DESCRIPTION: NO DESCRIPTION; LINK: UNKNOWN LINK; MANUFACTURER: Mentor; MANUFACTURERPARTNUMBER: 1270.1001; POPULATED: TRUE; ROHSCERTIFICATE: UNKNOWN ROHS CERTIFICATE; SOURCE: UNKNOWN SOURCE; SOURCEPARTNUMBER: UNKNOWN SOURCE PART NUMBER
PWR = LED-PLCC2:LED: OSRAM types LY T676, LS T670 in P-LLC2 package; CLASS: LED; DESCRIPTION: LED GREEN CLEAR 2PLCC SMD; LINK: https://www.digikey.de/product-detail/de/rohm-semiconductor/SML-Z14PTT86A/511-1645-1-ND; MANUFACTURER: Rohm Semiconductor; MANUFACTURERPARTNUMBER: SML-Z14PTT86A; POPULATED: TRUE; ROHSCERTIFICATE: UNKNOWN ROHS CERTIFICATE; SOURCE: DIGIKEY; SOURCEPARTNUMBER: 511-1645-1-ND
R1 = rc-sysmocom:RESISTOR: Resistors 0402 - 0402 Surface Mount Package 22 Ohm 1% 1/16W [Digikey: 311-22.0LRTR-ND] 33 Ohm 5% 1/16W 1.0K 5% 1/16W 1.5K 5% 1/16W 2.0K 1% 1/16W 10.0K 1% 1/16W [Digikey: 311-10.0KLRTR-ND] 10.0K 5% 1/16W [Digikey: RMCF0402JT10K0TR-ND] 12.1K 1% 1/16W [Digikey: 311-22.0LRTR-ND] 100.0K 5% 1/16W 0603 - 0603 Surface Mount Package 1/10 Watt 0805 - 0805 Surface Mount Package 1/8 Watt 1206 - 1206 Surface Mount Package 2012 - 2010 Surface Mount Package 0.11 Ohm 1/2 Watt 1% Resistor - Digikey: RHM.11UCT-ND; CLASS: RESISTOR; DESCRIPTION: RES 100 OHM 5%% 1/10W 0603; LINK: https://www.digikey.de/product-detail/de/stackpole-electronics-inc/RMCF0603JT100R/RMCF0603JT100RCT-ND; MANUFACTURER: Stackpole Electronics Inc; MANUFACTURERPARTNUMBER: RMCF0603JT100R; POPULATED: TRUE; ROHSCERTIFICATE: UNKNOWN ROHS CERTIFICATE; SOURCE: DIGIKEY; SOURCEPARTNUMBER: RMCF0603JT100RCT-ND
R2-R5 R44-R46 = rc-sysmocom:RESISTOR: Resistors 0402 - 0402 Surface Mount Package 22 Ohm 1% 1/16W [Digikey: 311-22.0LRTR-ND] 33 Ohm 5% 1/16W 1.0K 5% 1/16W 1.5K 5% 1/16W 2.0K 1% 1/16W 10.0K 1% 1/16W [Digikey: 311-10.0KLRTR-ND] 10.0K 5% 1/16W [Digikey: RMCF0402JT10K0TR-ND] 12.1K 1% 1/16W [Digikey: 311-22.0LRTR-ND] 100.0K 5% 1/16W 0603 - 0603 Surface Mount Package 1/10 Watt 0805 - 0805 Surface Mount Package 1/8 Watt 1206 - 1206 Surface Mount Package 2012 - 2010 Surface Mount Package 0.11 Ohm 1/2 Watt 1% Resistor - Digikey: RHM.11UCT-ND; CLASS: RESISTOR; DESCRIPTION: RES SMD 0 OHM JUMPER 1/10W 0603; LINK: https://www.digikey.de/product-detail/de/panasonic-electronic-components/ERJ-3GEY0R00V/P0-0GCT-ND/134711; MANUFACTURER: Panasonic Electronic Components; MANUFACTURERPARTNUMBER: ERJ-3GEY0R00V; POPULATED: TRUE; ROHSCERTIFICATE: UNKNOWN ROHS CERTIFICATE; SOURCE: DIGIKEY; SOURCEPARTNUMBER: P0.0GCT-ND
R6 R7 = rc-sysmocom:RESISTOR: Resistors 0402 - 0402 Surface Mount Package 22 Ohm 1% 1/16W [Digikey: 311-22.0LRTR-ND] 33 Ohm 5% 1/16W 1.0K 5% 1/16W 1.5K 5% 1/16W 2.0K 1% 1/16W 10.0K 1% 1/16W [Digikey: 311-10.0KLRTR-ND] 10.0K 5% 1/16W [Digikey: RMCF0402JT10K0TR-ND] 12.1K 1% 1/16W [Digikey: 311-22.0LRTR-ND] 100.0K 5% 1/16W 0603 - 0603 Surface Mount Package 1/10 Watt 0805 - 0805 Surface Mount Package 1/8 Watt 1206 - 1206 Surface Mount Package 2012 - 2010 Surface Mount Package 0.11 Ohm 1/2 Watt 1% Resistor - Digikey: RHM.11UCT-ND; CLASS: RESISTOR; DESCRIPTION: RES 33 OHM 5%% 1/10W 0603; LINK: https://www.digikey.de/product-detail/de/stackpole-electronics-inc/RMCF0603JT33R0/RMCF0603JT33R0CT-ND; MANUFACTURER: Stackpole Electronics Inc; MANUFACTURERPARTNUMBER: RMCF0603JT33R0; POPULATED: TRUE; ROHSCERTIFICATE: UNKNOWN ROHS CERTIFICATE; SOURCE: DIGIKEY; SOURCEPARTNUMBER: RMCF0603JT33R0CT-ND
R8 R10 R13 R16-R33 R36 R37 = rc-sysmocom:RESISTOR: Resistors 0402 - 0402 Surface Mount Package 22 Ohm 1% 1/16W [Digikey: 311-22.0LRTR-ND] 33 Ohm 5% 1/16W 1.0K 5% 1/16W 1.5K 5% 1/16W 2.0K 1% 1/16W 10.0K 1% 1/16W [Digikey: 311-10.0KLRTR-ND] 10.0K 5% 1/16W [Digikey: RMCF0402JT10K0TR-ND] 12.1K 1% 1/16W [Digikey: 311-22.0LRTR-ND] 100.0K 5% 1/16W 0603 - 0603 Surface Mount Package 1/10 Watt 0805 - 0805 Surface Mount Package 1/8 Watt 1206 - 1206 Surface Mount Package 2012 - 2010 Surface Mount Package 0.11 Ohm 1/2 Watt 1% Resistor - Digikey: RHM.11UCT-ND; CLASS: RESISTOR; DESCRIPTION: RES 10K OHM 5%% 1/10W 0603; LINK: https://www.digikey.de/product-detail/de/stackpole-electronics-inc/RMCF0603JT10K0/RMCF0603JT10K0CT-ND; MANUFACTURER: Stackpole Electronics Inc; MANUFACTURERPARTNUMBER: RMCF0603JT10K0; POPULATED: TRUE; ROHSCERTIFICATE: UNKNOWN ROHS CERTIFICATE; SOURCE: DIGIKEY; SOURCEPARTNUMBER: RMCF0603JT10K0CT-ND
R9 = rc-sysmocom:RESISTOR: Resistors 0402 - 0402 Surface Mount Package 22 Ohm 1% 1/16W [Digikey: 311-22.0LRTR-ND] 33 Ohm 5% 1/16W 1.0K 5% 1/16W 1.5K 5% 1/16W 2.0K 1% 1/16W 10.0K 1% 1/16W [Digikey: 311-10.0KLRTR-ND] 10.0K 5% 1/16W [Digikey: RMCF0402JT10K0TR-ND] 12.1K 1% 1/16W [Digikey: 311-22.0LRTR-ND] 100.0K 5% 1/16W 0603 - 0603 Surface Mount Package 1/10 Watt 0805 - 0805 Surface Mount Package 1/8 Watt 1206 - 1206 Surface Mount Package 2012 - 2010 Surface Mount Package 0.11 Ohm 1/2 Watt 1% Resistor - Digikey: RHM.11UCT-ND; CLASS: RESISTOR; DESCRIPTION: RES 1.5K OHM 5%% 1/10W 0603; LINK: https://www.digikey.de/product-detail/de/stackpole-electronics-inc/RMCF0603JT1K50/RMCF0603JT1K50CT-ND; MANUFACTURER: Stackpole Electronics Inc; MANUFACTURERPARTNUMBER: RMCF0603JT1K50; POPULATED: TRUE; ROHSCERTIFICATE: UNKNOWN ROHS CERTIFICATE; SOURCE: DIGIKEY; SOURCEPARTNUMBER: RMCF0603JT1K50CT-ND
R11 R12 = rc-sysmocom:RESISTOR: Resistors 0402 - 0402 Surface Mount Package 22 Ohm 1% 1/16W [Digikey: 311-22.0LRTR-ND] 33 Ohm 5% 1/16W 1.0K 5% 1/16W 1.5K 5% 1/16W 2.0K 1% 1/16W 10.0K 1% 1/16W [Digikey: 311-10.0KLRTR-ND] 10.0K 5% 1/16W [Digikey: RMCF0402JT10K0TR-ND] 12.1K 1% 1/16W [Digikey: 311-22.0LRTR-ND] 100.0K 5% 1/16W 0603 - 0603 Surface Mount Package 1/10 Watt 0805 - 0805 Surface Mount Package 1/8 Watt 1206 - 1206 Surface Mount Package 2012 - 2010 Surface Mount Package 0.11 Ohm 1/2 Watt 1% Resistor - Digikey: RHM.11UCT-ND; CLASS: RESISTOR; DESCRIPTION: RES SMD 100K OHM 5%% 1/10W 0603; LINK: https://www.digikey.de/product-detail/de/yageo/RC0603JR-07100KL/311-100KGRCT-ND/729645; MANUFACTURER: Yageo; MANUFACTURERPARTNUMBER: RC0603JR-07100KL; POPULATED: TRUE; ROHSCERTIFICATE: Bleifrei / RoHS-konform; SOURCE: DIGIKEY; SOURCEPARTNUMBER: 311-100KGRCT-ND
R14 = rc-sysmocom:RESISTOR: Resistors 0402 - 0402 Surface Mount Package 22 Ohm 1% 1/16W [Digikey: 311-22.0LRTR-ND] 33 Ohm 5% 1/16W 1.0K 5% 1/16W 1.5K 5% 1/16W 2.0K 1% 1/16W 10.0K 1% 1/16W [Digikey: 311-10.0KLRTR-ND] 10.0K 5% 1/16W [Digikey: RMCF0402JT10K0TR-ND] 12.1K 1% 1/16W [Digikey: 311-22.0LRTR-ND] 100.0K 5% 1/16W 0603 - 0603 Surface Mount Package 1/10 Watt 0805 - 0805 Surface Mount Package 1/8 Watt 1206 - 1206 Surface Mount Package 2012 - 2010 Surface Mount Package 0.11 Ohm 1/2 Watt 1% Resistor - Digikey: RHM.11UCT-ND; CLASS: RESISTOR; DESCRIPTION: RES 2.2K OHM 5%% 1/10W 0603; LINK: https://www.digikey.de/product-detail/de/stackpole-electronics-inc/RMCF0603JT2K20/RMCF0603JT2K20CT-ND; MANUFACTURER: Stackpole Electronics Inc; MANUFACTURERPARTNUMBER: RMCF0603JT2K20; POPULATED: TRUE; ROHSCERTIFICATE: UNKNOWN ROHS CERTIFICATE; SOURCE: DIGIKEY; SOURCEPARTNUMBER: RMCF0603JT2K20CT-ND
R15 R40 R41 = rc-sysmocom:RESISTOR: Resistors 0402 - 0402 Surface Mount Package 22 Ohm 1% 1/16W [Digikey: 311-22.0LRTR-ND] 33 Ohm 5% 1/16W 1.0K 5% 1/16W 1.5K 5% 1/16W 2.0K 1% 1/16W 10.0K 1% 1/16W [Digikey: 311-10.0KLRTR-ND] 10.0K 5% 1/16W [Digikey: RMCF0402JT10K0TR-ND] 12.1K 1% 1/16W [Digikey: 311-22.0LRTR-ND] 100.0K 5% 1/16W 0603 - 0603 Surface Mount Package 1/10 Watt 0805 - 0805 Surface Mount Package 1/8 Watt 1206 - 1206 Surface Mount Package 2012 - 2010 Surface Mount Package 0.11 Ohm 1/2 Watt 1% Resistor - Digikey: RHM.11UCT-ND; CLASS: RESISTOR; DESCRIPTION: RES SMD 330 OHM 1%% 1/10W 0603; LINK: https://www.digikey.de/product-detail/de/yageo/RC0603FR-07330RL/311-330HRCT-ND; MANUFACTURER: Yageo; MANUFACTURERPARTNUMBER: RC0603FR-07330RL; POPULATED: TRUE; ROHSCERTIFICATE: UNKNOWN ROHS CERTIFICATE; SOURCE: DIGIKEY; SOURCEPARTNUMBER: 311-330HRCT-ND
R34 R35 = rc-sysmocom:RESISTOR: Resistors 0402 - 0402 Surface Mount Package 22 Ohm 1% 1/16W [Digikey: 311-22.0LRTR-ND] 33 Ohm 5% 1/16W 1.0K 5% 1/16W 1.5K 5% 1/16W 2.0K 1% 1/16W 10.0K 1% 1/16W [Digikey: 311-10.0KLRTR-ND] 10.0K 5% 1/16W [Digikey: RMCF0402JT10K0TR-ND] 12.1K 1% 1/16W [Digikey: 311-22.0LRTR-ND] 100.0K 5% 1/16W 0603 - 0603 Surface Mount Package 1/10 Watt 0805 - 0805 Surface Mount Package 1/8 Watt 1206 - 1206 Surface Mount Package 2012 - 2010 Surface Mount Package 0.11 Ohm 1/2 Watt 1% Resistor - Digikey: RHM.11UCT-ND; CLASS: RESISTOR; DESCRIPTION: RES 3K OHM 1%% 1/10W 0603; LINK: https://www.digikey.de/product-detail/de/stackpole-electronics-inc/RMCF0603FT3K00/RMCF0603FT3K00CT-ND; MANUFACTURER: Stackpole Electronics Inc; MANUFACTURERPARTNUMBER: RMCF0603FT3K00; POPULATED: TRUE; ROHSCERTIFICATE: UNKNOWN ROHS CERTIFICATE; SOURCE: DIGIKEY; SOURCEPARTNUMBER: RMCF0603FT3K00CT-ND
R38 R39 = rc-sysmocom:RESISTOR: Resistors 0402 - 0402 Surface Mount Package 22 Ohm 1% 1/16W [Digikey: 311-22.0LRTR-ND] 33 Ohm 5% 1/16W 1.0K 5% 1/16W 1.5K 5% 1/16W 2.0K 1% 1/16W 10.0K 1% 1/16W [Digikey: 311-10.0KLRTR-ND] 10.0K 5% 1/16W [Digikey: RMCF0402JT10K0TR-ND] 12.1K 1% 1/16W [Digikey: 311-22.0LRTR-ND] 100.0K 5% 1/16W 0603 - 0603 Surface Mount Package 1/10 Watt 0805 - 0805 Surface Mount Package 1/8 Watt 1206 - 1206 Surface Mount Package 2012 - 2010 Surface Mount Package 0.11 Ohm 1/2 Watt 1% Resistor - Digikey: RHM.11UCT-ND; CLASS: RESISTOR; DESCRIPTION: RES 120 OHM 5%% 1/10W 0603; LINK: https://www.digikey.de/product-detail/de/stackpole-electronics-inc/RMCF0603JT120R/RMCF0603JT120RCT-ND; MANUFACTURER: Stackpole Electronics Inc; MANUFACTURERPARTNUMBER: RMCF0603JT120R; POPULATED: TRUE; ROHSCERTIFICATE: UNKNOWN ROHS CERTIFICATE; SOURCE: DIGIKEY; SOURCEPARTNUMBER: RMCF0603JT120RCT-ND
R42 R43 = rc-sysmocom:RESISTOR: Resistors 0402 - 0402 Surface Mount Package 22 Ohm 1% 1/16W [Digikey: 311-22.0LRTR-ND] 33 Ohm 5% 1/16W 1.0K 5% 1/16W 1.5K 5% 1/16W 2.0K 1% 1/16W 10.0K 1% 1/16W [Digikey: 311-10.0KLRTR-ND] 10.0K 5% 1/16W [Digikey: RMCF0402JT10K0TR-ND] 12.1K 1% 1/16W [Digikey: 311-22.0LRTR-ND] 100.0K 5% 1/16W 0603 - 0603 Surface Mount Package 1/10 Watt 0805 - 0805 Surface Mount Package 1/8 Watt 1206 - 1206 Surface Mount Package 2012 - 2010 Surface Mount Package 0.11 Ohm 1/2 Watt 1% Resistor - Digikey: RHM.11UCT-ND; CLASS: RESISTOR; DESCRIPTION: RES 1K OHM 5%% 1/10W 0603; LINK: https://www.digikey.de/product-detail/de/stackpole-electronics-inc/RMCF0603JT1K00/RMCF0603JT1K00CT-ND/1943173; MANUFACTURER: Stackpole Electronics Inc; MANUFACTURERPARTNUMBER: RMCF0603JT1K00; POPULATED: TRUE; ROHSCERTIFICATE: UNKNOWN ROHS CERTIFICATE; SOURCE: DIGIKEY; SOURCEPARTNUMBER: RMCF0603JT1K00CT-ND
SW1 = tact-switches:TL3340: TL3340 series by E-Switch https://www.e-switch.com/system/asset/product_line/data_sheet/164/TL3340.pdf; CLASS: SWITCH; DESCRIPTION: SWITCH TACTILE SPST-NO 0.05A 12V; LINK: https://www.digikey.de/product-detail/de/e-switch/TL3340AF160QG/EG4627CT-ND/1885974; MANUFACTURER: E-Switch; MANUFACTURERPARTNUMBER: TL3340AF160QG; POPULATED: TRUE; ROHSCERTIFICATE: Bleifrei / RoHS-konform; SOURCE: DIGIKEY; SOURCEPARTNUMBER: EG4627CT-ND
T1 T2 = transistor:*-NPN-: NPN Transistror BF959 corrected 2008.03.06; CLASS: TRANSISTOR; DESCRIPTION: TRANS NPN 45V 0.1A SOT23; LINK: https://www.digikey.de/product-detail/de/nexperia-usa-inc/BC847C,215/1727-2924-1-ND; MANUFACTURER: Nexperia USA Inc.; MANUFACTURERPARTNUMBER: BC847C,215; POPULATED: TRUE; ROHSCERTIFICATE: UNKNOWN ROHS CERTIFICATE; SOURCE: DIGIKEY; SOURCEPARTNUMBER: 1727-2924-1-ND
TP1-TP4 = testpad:TP: Test pad; CLASS: UNKNOWN CLASS; DESCRIPTION: NO DESCRIPTION; LINK: UNKNOWN LINK; MANUFACTURER: UNKNOWN MANUFACTURER; MANUFACTURERPARTNUMBER: UNKNOWN MANUFACTURER PART NUMBER; POPULATED: TRUE; ROHSCERTIFICATE: UNKNOWN ROHS CERTIFICATE; SOURCE: UNKNOWN SOURCE; SOURCEPARTNUMBER: UNKNOWN SOURCE PART NUMBER
TR1 TR2 = laforge:PULSE_T1094NL; CLASS: TRANSFORMER; DESCRIPTION: TRANSFORMER TELECOM DUAL T1/E2; LINK: https://www.digikey.de/product-detail/de/pulse-electronics-network/T1094NL/553-1449-ND; MANUFACTURER: Pulse Electronics Network; MANUFACTURERPARTNUMBER: T1094NL; POPULATED: TRUE; ROHSCERTIFICATE: UNKNOWN ROHS CERTIFICATE; SOURCE: DIGIKEY; SOURCEPARTNUMBER: 553-1449-ND
U1 = ice40:ICE40UP5K-SG48I: Field Programmable Gate Array iCE40-UltraPlus, 5280 LUTs, 1.2V; CLASS: IC; DESCRIPTION: IC FPGA 39 I/O 48QFN; LINK: https://www.digikey.de/product-detail/de/lattice-semiconductor-corporation/ICE40UP5K-SG48I/220-2212-1-ND/; MANUFACTURER: Lattice Semiconductor Corporation; MANUFACTURERPARTNUMBER: ICE40UP5K-SG48I; POPULATED: TRUE; ROHSCERTIFICATE: UNKNOWN ROHS CERTIFICATE; SOURCE: DIGIKEY; SOURCEPARTNUMBER: 220-2212-1-ND
U2 U3 = laforge:IP4234CZ6: NXP IP4234CZ6 - Single USB 2.0 ESD protection to IEC 61000-4-2 level 4; CLASS: IC; DESCRIPTION: TVS DIODE 5.5V 6TSOP; LINK: https://www.digikey.de/product-detail/de/nexperia-usa-inc/IP4234CZ6125/1727-4717-1-ND/2531156; MANUFACTURER: Nexperia USA Inc.; MANUFACTURERPARTNUMBER: IP4234CZ6,125; OC_DIGIKEY: 568-5869-1-ND; POPULATED: TRUE; ROHSCERTIFICATE: Bleifrei / RoHS-konform; SOURCE: DIGIKEY; SOURCEPARTNUMBER: 1727-4717-1-ND
U4 U5 = laforge:IDT82V2081; CLASS: IC; DESCRIPTION: IC TELECOM INTERFACE 44TQFP; LINK: https://www.digikey.de/product-detail/de/renesas-electronics-america-inc/82V2081PPG/800-2347-ND; MANUFACTURER: Renesas Electronics America Inc.; MANUFACTURERPARTNUMBER: 82V2081PPG; POPULATED: TRUE; ROHSCERTIFICATE: UNKNOWN ROHS CERTIFICATE; SOURCE: DIGIKEY; SOURCEPARTNUMBER: 800-2347-ND
U6 = laforge:FOX_FXO-HC73; CLASS: IC / XTAL / XO; DESCRIPTION: XTAL OSC XO 2.0480MHZ HCMOS SMD; LINK: https://www.digikey.de/product-detail/de/renesas-electronics-america-inc/XLH736002-048000I/631-1182-ND; MANUFACTURER: Renesas Electronics America Inc.; MANUFACTURERPARTNUMBER: XLH736002.048000I; POPULATED: TRUE; ROHSCERTIFICATE: UNKNOWN ROHS CERTIFICATE; SOURCE: DIGIKEY; SOURCEPARTNUMBER: 631-1182-ND
U7 = laforge:FOX_FXO-HC73; CLASS: IC / XTAL / XO; DESCRIPTION: NO DESCRIPTION; LINK: UNKNOWN LINK; MANUFACTURER: UNKNOWN MANUFACTURER; MANUFACTURERPARTNUMBER: UNKNOWN MANUFACTURER PART NUMBER; POPULATED: FALSE; ROHSCERTIFICATE: UNKNOWN ROHS CERTIFICATE; SOURCE: UNKNOWN SOURCE; SOURCEPARTNUMBER: UNKNOWN SOURCE PART NUMBER
X1 = con-hirose:MINI-USB-SHIELD-: MINI USB Connector Source: http://www.hirose.co.jp/cataloge_hp/e24000019.pdf; CLASS: CONNECTOR; DESCRIPTION: CONN RCPT USB2.0 MINI B SMD R/A; LINK: https://www.digikey.de/product-detail/de/hirose-electric-co-ltd/UX60A-MB-5ST/H2961CT-ND/597540; MANUFACTURER: Hirose Electric Co Ltd; MANUFACTURERPARTNUMBER: UX60A-MB-5ST; OC_FARNELL: unknown; OC_NEWARK: unknown; POPULATED: TRUE; ROHSCERTIFICATE: Bleifrei / RoHS-konform; SOURCE: DIGIKEY; SOURCEPARTNUMBER: H2961CT-ND
X2 = laforge:JACK2.5_SJ-2523: CUI Inc. SJ-2523-SMT; CLASS: CONNECTOR; DESCRIPTION: CONN JACK STEREO 2.5MM SMD R/A; LINK: https://www.digikey.de/product-detail/de/cui-inc/SJ-2523-SMT-TR/CP-2523SJCT-ND/669702; MANUFACTURER: CUI Inc.; MANUFACTURERPARTNUMBER: SJ-2523-SMT-TR; POPULATED: TRUE; ROHSCERTIFICATE: Bleifrei / RoHS-konform; SOURCE: DIGIKEY; SOURCEPARTNUMBER: CP-2523SJCT-ND

## Net classes
1 supply: width 0.4 mm, clearance 0.3 mm to class 0, clearance 0.4 mm
2 usb: width 0.6 mm, drill 0.2 mm, clearance 0.2 mm to class 0, clearance 0.2 mm to class 1, clearance 0.2 mm
3 gnd-poly: width 0.4 mm, drill 0.2 mm, clearance 0.3 mm to class 0, clearance 0.4 mm to class 1, clearance 0.2 mm to class 2, clearance 0.2 mm